# Altium schematic sheet Ethernet.SchDoc: Ethernet
size A4; DocumentNumber: MB1165; Revision: C.1; SheetNumber: 7; SheetTotal: 17; Project: STM32469I-EVAL
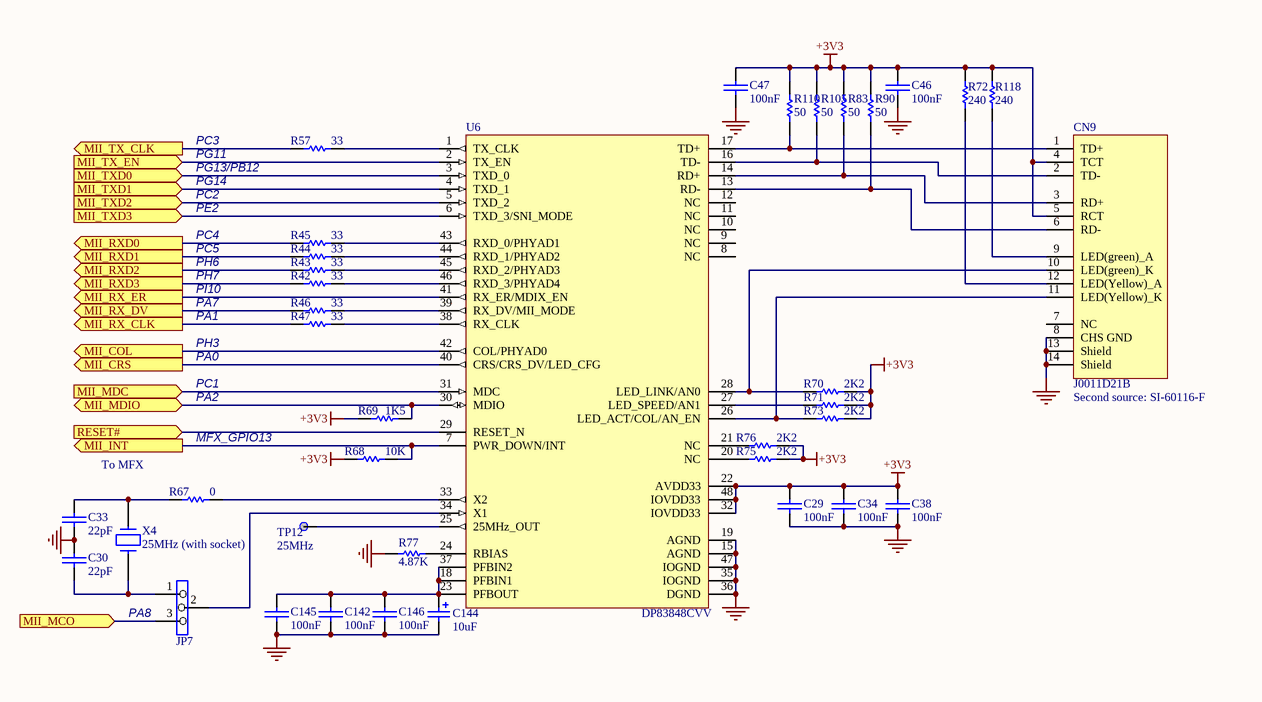
[diagram p0: Ethernet.SchDoc]

## Parts
C29  100nF  [0603C]
C30  22pF  [0603C]
C33  22pF  [0603C]
C34  100nF  [0603C]
C38  100nF  [0603C]
C46  100nF  [0603C]
C47  100nF  [0603C]
C142  100nF  [0603C]
C144  10uF  [TAN-A]
C145  100nF  [0603C]
C146  100nF  [0603C]
CN9  J0011D21B  [RJ45_J0011D01BNL]
JP7  (no value)  [SIP3]
R42  33  [0603R]
R43  33  [0603R]
R44  33  [0603R]
R45  33  [0603R]
R46  33  [0603R]
R47  33  [0603R]
R57  33  [0603R]
R67  0  [0603R]
R68  10K  [0603R]
R69  1K5  [0603R]
R70  2K2  [0603R]
R71  2K2  [0603R]
R72  240  [0603R]
R73  2K2  [0603R]
R75  2K2  [0603R]
R76  2K2  [0603R]
R77  4.87K  [0603R]
R83  50  [0603R]
R90  50  [0603R]
R105  50  [0603R]
R110  50  [0603R]
R118  240  [0603R]
TP12  25MHz  [TP]
U6  DP83848CVV  [LQFP48_0R5_9X9]
X4  25MHz (with socket)  [XTAL_socket]

## Ports
MII_COL (out), MII_CRS (out), MII_INT (out), MII_MCO (in), MII_MDC (in), MII_MDIO (bidir), MII_RX_CLK (out), MII_RX_DV (out), MII_RX_ER (out), MII_RXD0 (out), MII_RXD1 (out), MII_RXD2 (out), MII_RXD3 (out), MII_TX_CLK (out), MII_TX_EN (in), MII_TXD0 (in), MII_TXD1 (in), MII_TXD2 (in), MII_TXD3 (in), RESET# (in)

## Nets
+3V3: C29.1 C34.2 C38.2 C46.2 C47.2 CN9.4(TCT) CN9.5(RCT) R68.1 R69.2 R70.2 R71.2 R72.2 R73.2 R75.2 R76.2 R83.1 R90.1 R105.1 R110.1 R118.2 U6.22(AVDD33) U6.32(IOVDD33) U6.48(IOVDD33)
GND: C29.2 C30.2 C33.1 C34.1 C38.1 C46.1 C47.1 C142.1 C144.2 C145.2 C146.1 CN9.8(CHS_GND) CN9.13(Shield) CN9.14(Shield) R77.1 U6.15(AGND) U6.19(AGND) U6.35(IOGND) U6.36(DGND) U6.47(IOGND)
MII_COL: U6.42(COL/PHYAD0) ; port MII_COL
MII_CRS: U6.40(CRS/CRS_DV/LED_CFG) ; port MII_CRS
MII_INT: R68.2 U6.7(PWR_DOWN/INT) ; port MII_INT
MII_MCO: JP7.3 ; port MII_MCO
MII_MDC: U6.31(MDC) ; port MII_MDC
MII_MDIO: R69.1 U6.30(MDIO) ; port MII_MDIO
MII_RX_CLK: R47.2 ; port MII_RX_CLK
MII_RX_DV: R46.2 ; port MII_RX_DV
MII_RX_ER: U6.41(RX_ER/MDIX_EN) ; port MII_RX_ER
MII_RXD0: R45.2 ; port MII_RXD0
MII_RXD1: R44.2 ; port MII_RXD1
MII_RXD2: R43.2 ; port MII_RXD2
MII_RXD3: R42.2 ; port MII_RXD3
MII_TX_CLK: R57.2 ; port MII_TX_CLK
MII_TX_EN: U6.2(TX_EN) ; port MII_TX_EN
MII_TXD0: U6.3(TXD_0) ; port MII_TXD0
MII_TXD1: U6.4(TXD_1) ; port MII_TXD1
MII_TXD2: U6.5(TXD_2) ; port MII_TXD2
MII_TXD3: U6.6(TXD_3/SNI_MODE) ; port MII_TXD3
RESET#: U6.29(RESET_N) ; port RESET#
NetC30_1: C30.1 JP7.1 X4.1
NetC33_2: C33.2 R67.2 X4.2
NetC142_2: C142.2 C144.1 C145.1 C146.2 U6.18(PFBIN1) U6.23(PFBOUT) U6.37(PFBIN2)
NetCN9_1: CN9.1(TD+) R110.2 U6.17(TD+)
NetCN9_2: CN9.2(TD-) R105.2 U6.16(TD-)
NetCN9_3: CN9.3(RD+) R83.2 U6.14(RD+)
NetCN9_6: CN9.6(RD-) R90.2 U6.13(RD-)
NetCN9_9: CN9.9(LED(green)_A) R118.1
NetCN9_10: CN9.10(LED(green)_K) R70.1 U6.28(LED_LINK/AN0)
NetCN9_11: CN9.11(LED(Yellow)_K) R73.1 U6.26(LED_ACT/COL/AN_EN)
NetCN9_12: CN9.12(LED(Yellow)_A) R72.1
NetJP7_2: JP7.2 U6.34(X1)
NetR42_1: R42.1 U6.46(RXD_3/PHYAD4)
NetR43_1: R43.1 U6.45(RXD_2/PHYAD3)
NetR44_1: R44.1 U6.44(RXD_1/PHYAD2)
NetR45_1: R45.1 U6.43(RXD_0/PHYAD1)
NetR46_1: R46.1 U6.39(RX_DV/MII_MODE)
NetR47_1: R47.1 U6.38(RX_CLK)
NetR57_1: R57.1 U6.1(TX_CLK)
NetR67_1: R67.1 U6.33(X2)
NetR71_1: R71.1 U6.27(LED_SPEED/AN1)
NetR75_1: R75.1 U6.20(NC)
NetR76_1: R76.1 U6.21(NC)
NetR77_2: R77.2 U6.24(RBIAS)
NetTP12_1: TP12.1 U6.25(25MHz_OUT)

Not connected (* = marked no-connect by the designer): CN9 7(NC); U6 8(NC) 9(NC) 10(NC) 11(NC) 12(NC)

## Notes on the sheet
- PC3
- PG11
- PG13/PB12
- PG14
- PC2
- PE2
- PC4
- PC5
- PH6
- PH7
- PI10
- PA7
- PH3
- PA1
- PA0
- PC1
- PA2
- (near CN9) Second source: SI-60116-F
- To MFX
- MFX_GPIO13
- (near JP7) PA8
- Title:
- Project:
- Size:
- Date:
- A4
- Reference:
- Sheet:
- Revision:
- of

## Library data of the parts
C29 C30 C33 C34 C38 C46 C47 C142 C145 C146 = CAP: Capacitor
C144 = Cap Pol1: Polarized Capacitor (Radial); Published: 8-Jun-2000; Revision: July-2002: Re-released for DXP Platform.; Publisher: Altium Limited; Value: 10uF
JP7 = Jumper3
R42-R47 R57 R67-R73 R75-R77 R83 R90 R105 R110 R118 = Res1: Resistor; Value: 1K; Published: 8-Jun-2000; Revision: July-2002: Re-released for DXP Platform.; Publisher: Altium Limited
TP12 = TP
X4 = CRYSTAL